# Altium project Synthesizer Build part-24 ADSR with 7555_V1.PrjPcb
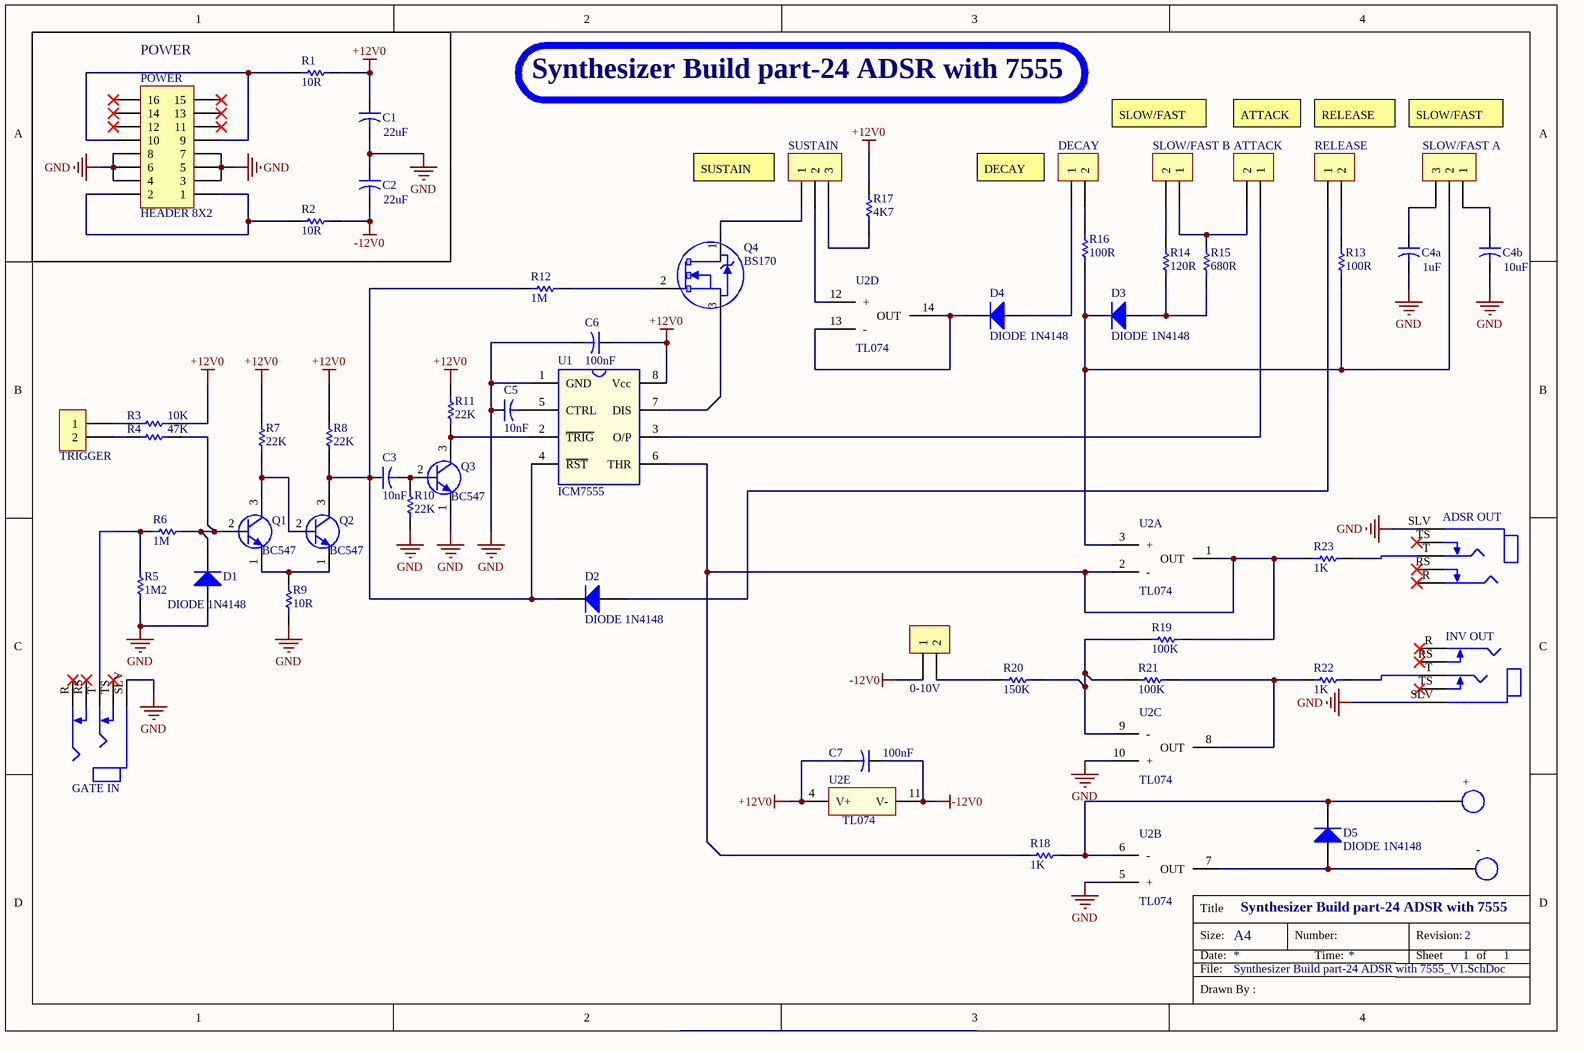
[diagram p0: Synthesizer Build part-24 ADSR with 7555_V1.SchDoc]
1 sheet, 56 parts. Net scope: global (net labels, ports and power ports of the same name join across sheets).
Board file: Synthesizer Build part-24 ADSR with 7555_TC_V1.PcbDoc

## Sheet Synthesizer Build part-24 ADSR with 7555_V1.SchDoc
size A4; Organization: Altium Limited; Address1: 3 Minna Close; Address2: Belrose; Address3: NSW 2085; Address4: Australia; DocumentNumber: 1; Revision: 2.0; SheetNumber: 1; SheetTotal: 1

### Parts
0-10V  SCREW TERMINAL 2WAY  [SCREW TERMINAL 2WAY]  (value not drawn)
+  Hole  [LED_HOle]  (value not drawn)
-  Hole  [LED_HOle]  (value not drawn)
ADSR_OUT  N114BPCX  [SWITCHCRAFT_N114BPCX]  (value not drawn)
ATTACK  SCREW TERMINAL 2WAY  [SCREW TERMINAL 2WAY]  (value not drawn)
C1  22uF  [CAP 5X11]
C2  22uF  [CAP 5X11]
C3  10nF  [CAP RAD-0.3]
C4a  1uF  [CAP RAD-0.3]
C4b  10uF  [CAP 5X11]
C5  10nF  [CAP RAD-0.3]
C6  100nF  [CAP RAD-0.3]
C7  100nF  [CAP RAD-0.3]
D1  DIODE 1N4148  [DO-35]
D2  DIODE 1N4148  [DO-35]
D3  DIODE 1N4148  [DO-35]
D4  DIODE 1N4148  [DO-35]
D5  DIODE 1N4148  [DO-35]
DECAY  SCREW TERMINAL 2WAY  [SCREW TERMINAL 2WAY]  (value not drawn)
GATE_IN  N114BPCX  [SWITCHCRAFT_N114BPCX]  (value not drawn)
INV_OUT  N114BPCX  [SWITCHCRAFT_N114BPCX]  (value not drawn)
POWER  HEADER 8X2  [HEADER 8X2]
Q1  BC547  [TO92]
Q2  BC547  [TO92]
Q3  BC547  [TO92]
Q4  BS170  [TO92]
R1  10R  [RES 6.2 x 0.5 x 2.3]
R2  10R  [RES 6.2 x 0.5 x 2.3]
R3  10K  [RES 6.2 x 0.5 x 2.3]
R4  47K  [RES 6.2 x 0.5 x 2.3]
R5  1M2  [RES 6.2 x 0.5 x 2.3]
R6  1M  [RES 6.2 x 0.5 x 2.3]
R7  22K  [RES 6.2 x 0.5 x 2.3]
R8  22K  [RES 6.2 x 0.5 x 2.3]
R9  10R  [RES 6.2 x 0.5 x 2.3]
R10  22K  [RES 6.2 x 0.5 x 2.3]
R11  22K  [RES 6.2 x 0.5 x 2.3]
R12  1M  [RES 6.2 x 0.5 x 2.3]
R13  100R  [RES 6.2 x 0.5 x 2.3]
R14  120R  [RES 6.2 x 0.5 x 2.3]
R15  680R  [RES 6.2 x 0.5 x 2.3]
R16  100R  [RES 6.2 x 0.5 x 2.3]
R17  4K7  [RES 6.2 x 0.5 x 2.3]
R18  1K  [RES 6.2 x 0.5 x 2.3]
R19  100K  [RES 6.2 x 0.5 x 2.3]
R20  150K  [RES 6.2 x 0.5 x 2.3]
R21  100K  [RES 6.2 x 0.5 x 2.3]
R22  1K  [RES 6.2 x 0.5 x 2.3]
R23  1K  [RES 6.2 x 0.5 x 2.3]
RELEASE  SCREW TERMINAL 2WAY  [SCREW TERMINAL 2WAY]  (value not drawn)
SLOW/FAST_A  SCREW TERMINAL 3WAY  [SCREW TERMINAL 3WAY]  (value not drawn)
SLOW/FAST_B  SCREW TERMINAL 2WAY  [SCREW TERMINAL 2WAY]  (value not drawn)
SUSTAIN  SCREW TERMINAL 3WAY  [SCREW TERMINAL 3WAY]  (value not drawn)
TRIGGER  SCREW TERMINAL 2WAY  [SCREW TERMINAL 2WAY]  (value not drawn)
U1  ICM7555  [DIP 8 PIN]
U2  TL074  [DIP 14 PIN]  (parts A,B,C,D,E of 5)

### Blocks framed on the sheet
POWER: C1 C2 POWER R1 R2

### Nets
+12V0: C1.1 C6.1 C7.2 R1.1 R3.2 R7.2 R8.2 R11.2 R17.1 U1.8(Vcc) U2.4(V+)
-12V0: 0-10V.1 C2.2 C7.1 R2.1 U2.11(V-)
GND: ADSR_OUT.SLV(SLEEVE) C1.2 C2.1 C4a.2 C4b.2 C5.1 C6.2 D1.1(A) GATE_IN.SLV(SLEEVE) INV_OUT.SLV(SLEEVE) POWER.3 POWER.4 POWER.5 POWER.6 POWER.7 POWER.8 Q3.1(C) R5.1 R9.1 R10.1 U1.1(GND) U2.5(+) U2.10(+)
Net0-10V_2: 0-10V.2 R20.2
Net+_1: +.1 D5.2(K) R18.1 U2.6(-)
Net-_1: -.1 D5.1(A) U2.7(OUT)
NetADSR_OUT_T: ADSR_OUT.T(TIP) R23.1
NetATTACK_1: ATTACK.1 U1.3(O/P)
NetATTACK_2: ATTACK.2 R15.1 SLOW/FAST_B.1
NetC3_1: C3.1 D2.2(K) Q2.3(E) R8.1 R12.2 U1.4(~{RST})
NetC3_2: C3.2 Q3.2(B) R10.2
NetC4a_1: C4a.1 SLOW/FAST_A.3
NetC4b_1: C4b.1 SLOW/FAST_A.1
NetC5_2: C5.2 U1.5(CTRL)
NetD1_2: D1.2(K) Q1.2(B) R4.2 R6.1
NetD2_1: D2.1(A) RELEASE.1
NetD3_1: D3.1(A) R14.1 R15.2
NetD3_2: D3.2(K) R13.2 R16.2 SLOW/FAST_A.2 U2.3(+)
NetD4_1: D4.1(A) DECAY.1
NetD4_2: D4.2(K) U2.13(-) U2.14(OUT)
NetDECAY_2: DECAY.2 R16.1
NetGATE_IN_T: GATE_IN.T(TIP) R5.2 R6.2
NetINV_OUT_T: INV_OUT.T(TIP) R22.1
NetPOWER_1: POWER.1 POWER.2 R2.2
NetPOWER_9: POWER.9 POWER.10 R1.2
NetQ1_1: Q1.1(C) Q2.1(C) R9.2
NetQ1_3: Q1.3(E) Q2.2(B) R7.1
NetQ3_3: Q3.3(E) R11.1 U1.2(~{TRIG})
NetQ4_1: Q4.1(D) SUSTAIN.1
NetQ4_2: Q4.2(G) R12.1
NetQ4_3: Q4.3(S) U1.7(DIS)
NetR3_1: R3.1 TRIGGER.1
NetR4_1: R4.1 TRIGGER.2
NetR13_1: R13.1 RELEASE.2
NetR14_2: R14.2 SLOW/FAST_B.2
NetR17_2: R17.2 SUSTAIN.3
NetR18_2: R18.2 R19.1 R23.2 U1.6(THR) U2.1(OUT) U2.2(-)
NetR19_2: R19.2 R20.1 R21.2 U2.9(-)
NetR21_1: R21.1 R22.2 U2.8(OUT)
NetSUSTAIN_2: SUSTAIN.2 U2.12(+)

Not connected (* = marked no-connect by the designer): ADSR_OUT R(RING)* RS(RING_SHUNT)* TS(TIP_SHUNT)*; GATE_IN R(RING)* RS(RING_SHUNT)* TS(TIP_SHUNT)*; INV_OUT R(RING)* RS(RING_SHUNT)* TS(TIP_SHUNT)*; POWER 11* 12* 13* 14* 15* 16*

### Notes on the sheet
- Synthesizer Build part-24 ADSR with 7555
- (near SUSTAIN) SUSTAIN
- (near DECAY) DECAY
- SLOW/FAST
- ATTACK
- RELEASE
- 1
- 2
- Title
- Size:
- Date:
- File:
- A4
- Number:
- Time:
- Revision:
- Sheet
- of
- Drawn By :

### Library data of the parts
0-10V ATTACK DECAY RELEASE SLOW/FAST_B TRIGGER = SCREW TERMINAL 2WAY: SCREW TERMINAL 2WAY 5.08mm
ADSR_OUT GATE_IN INV_OUT = N114BPCX: Conn 1/4'' Phone Jack F 3 POS Solder ST Thru-Hole 5 Terminal 1 Port; Package: None; Price: None; Value: *; MP: N114BPCX; Availability: Unavailable
C1-C3 C4a C4b C5-C7 = Capacitor Polar
  C1 C2: VALUE: 22uF
  C3 C5: VALUE: 10nF
  C4a: VALUE: 1uF
  C4b: VALUE: 10uF
  C6 C7: VALUE: 100nF
D1-D5 = DIODE 1N4148: Small Signal Fast Switching Diodes
Q1-Q3 = BC547: NPN Epitaxial Silicon Transistor
Q4 = BS170: Small Signal N Channel MOSFET
R1-R23 = Res2: Resistor; Published: 8-Jun-2000; LatestRevisionDate: 17-Jul-2002; LatestRevisionNote: Re-released for DXP Platform.; PackageReference: AXIAL-0.4; Publisher: Altium Limited
  R1 R2 R9: Value: 10R
  R3: Value: 10K
  R4: Value: 47K
  R5: Value: 1M2
  R6 R12: Value: 1M
  R7 R8 R10 R11: Value: 22K
  R13 R16: Value: 100R
  R14: Value: 120R
  R15: Value: 680R
  R17: Value: 4K7
  R18 R22 R23: Value: 1K
  R19 R21: Value: 100K
  R20: Value: 150K
SLOW/FAST_A SUSTAIN = SCREW TERMINAL 3WAY: SCREW TERMINAL 3WAY 5.08mm
U1 = ICM7555: General purpose CMOS timer
U2 = TL074: Low-Noise FET-Input Operational Amplifiers